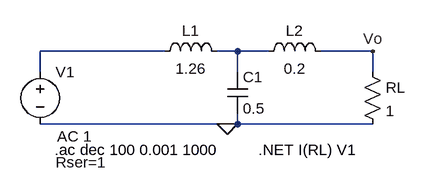
[diagram p0: schematic simu.asc]
simu.asc, the LTspice schematic file:
Version 4
SHEET 1 880 680
WIRE 176 112 -16 112
WIRE 288 112 256 112
WIRE 336 112 288 112
WIRE 496 112 416 112
WIRE -16 144 -16 112
WIRE 288 144 288 112
WIRE 496 144 496 112
WIRE 272 224 -16 224
WIRE 288 224 288 208
WIRE 288 224 272 224
WIRE 496 224 288 224
FLAG 272 224 0
FLAG 496 112 Vo
SYMBOL voltage -16 128 R0
WINDOW 123 26 115 Left 2
WINDOW 39 24 155 Left 2
SYMATTR InstName V1
SYMATTR Value ""
SYMATTR Value2 AC 1
SYMATTR SpiceLine Rser=1
SYMBOL ind 160 128 R270
WINDOW 0 32 56 VTop 2
WINDOW 3 5 56 VBottom 2
SYMATTR InstName L1
SYMATTR Value 1.26
SYMBOL cap 272 144 R0
SYMATTR InstName C1
SYMATTR Value 0.5
SYMBOL ind 320 128 R270
WINDOW 0 32 56 VTop 2
WINDOW 3 5 56 VBottom 2
SYMATTR InstName L2
SYMATTR Value 0.2
SYMBOL res 480 128 R0
SYMATTR InstName RL
SYMATTR Value 1
TEXT 6 264 Left 2 !.ac dec 100 0.001 1000
TEXT 320 264 Left 2 !.NET I(RL) V1

The netlist it stands for:
* simu.asc
V1 N001 0 AC 1 Rser=1
L1 N001 N002 1.26
C1 N002 0 0.5
L2 N002 Vo 0.2
RL Vo 0 1
.ac dec 100 0.001 1000
.NET I(RL) V1
.backanno
.end